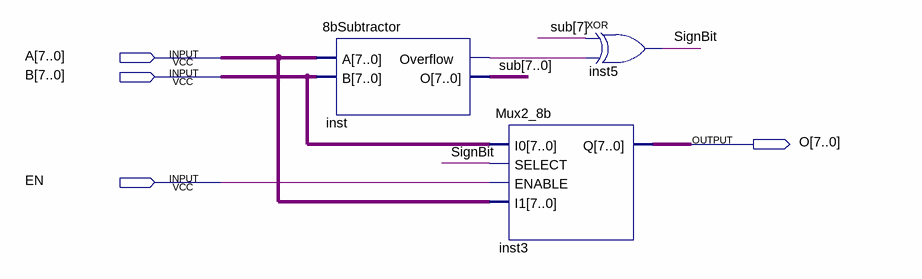
[diagram p0: schematic sheet]
// Quartus schematic Min2_8b.bdf as structural Verilog: 3 symbols, 4 pins
module Min2_8b (
  input  [7:0] A,
  input  [7:0] B,
  input  EN,
  output [7:0] O
);

  wire inst_overflow, SignBit;
  wire [7:0] sub;

  \8bSubtractor  inst (.A(A), .B(B), .Overflow(inst_overflow), .O(sub));
  Mux2_8b inst3 (.I0(B), .SELECT(SignBit), .ENABLE(EN), .I1(A), .Q(O));
  xor inst5 (SignBit, sub[7], inst_overflow);
endmodule
